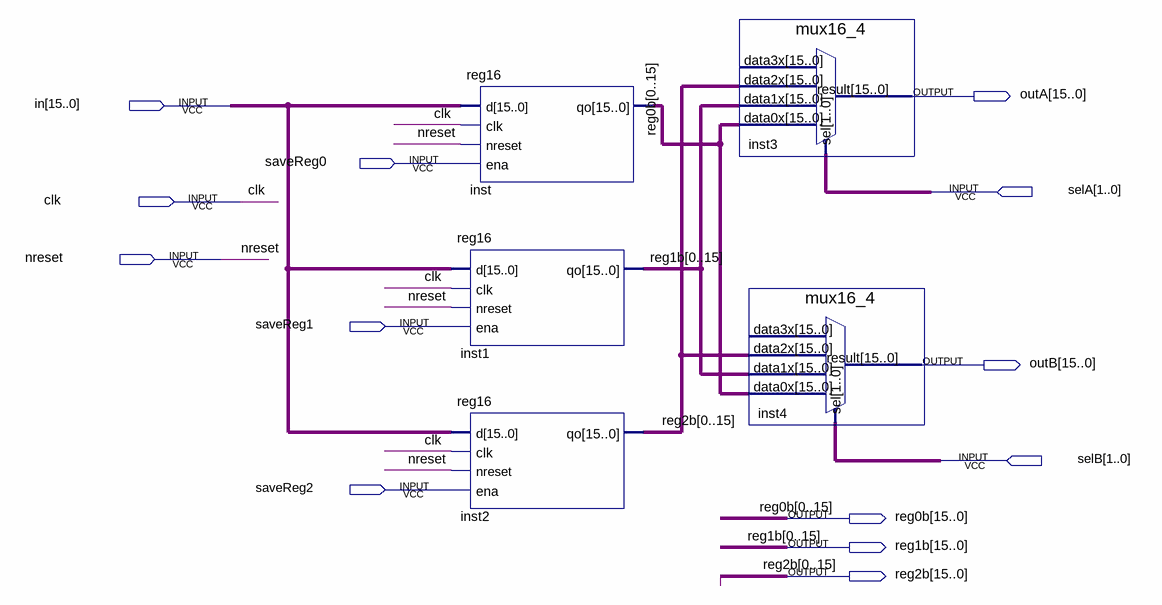
[diagram p0: schematic sheet]
// Quartus schematic regbank.bdf as structural Verilog: 5 symbols, 13 pins
module regbank (
  input  [15:0] in,
  input  saveReg0,
  input  [1:0] selA,
  input  clk,
  input  nreset,
  input  saveReg1,
  input  [1:0] selB,
  input  saveReg2,
  output [15:0] outA,
  output [15:0] outB,
  output [15:0] reg0b,
  output [15:0] reg1b,
  output [15:0] reg2b
);

  reg16 inst (
    .d(in), .clk(clk), .nreset(nreset), .ena(saveReg0),
    .qo({reg0b[0], reg0b[1], reg0b[2], reg0b[3], reg0b[4], reg0b[5], reg0b[6], reg0b[7], reg0b[8], reg0b[9], reg0b[10], reg0b[11], reg0b[12], reg0b[13], reg0b[14], reg0b[15]}));
  reg16 inst1 (
    .d(in), .clk(clk), .nreset(nreset), .ena(saveReg1),
    .qo({reg1b[0], reg1b[1], reg1b[2], reg1b[3], reg1b[4], reg1b[5], reg1b[6], reg1b[7], reg1b[8], reg1b[9], reg1b[10], reg1b[11], reg1b[12], reg1b[13], reg1b[14], reg1b[15]}));
  reg16 inst2 (
    .d(in), .clk(clk), .nreset(nreset), .ena(saveReg2),
    .qo({reg2b[0], reg2b[1], reg2b[2], reg2b[3], reg2b[4], reg2b[5], reg2b[6], reg2b[7], reg2b[8], reg2b[9], reg2b[10], reg2b[11], reg2b[12], reg2b[13], reg2b[14], reg2b[15]}));
  mux16_4 inst3 (
    .data2x({reg2b[0], reg2b[1], reg2b[2], reg2b[3], reg2b[4], reg2b[5], reg2b[6], reg2b[7], reg2b[8], reg2b[9], reg2b[10], reg2b[11], reg2b[12], reg2b[13], reg2b[14], reg2b[15]}),
    .data1x({reg1b[0], reg1b[1], reg1b[2], reg1b[3], reg1b[4], reg1b[5], reg1b[6], reg1b[7], reg1b[8], reg1b[9], reg1b[10], reg1b[11], reg1b[12], reg1b[13], reg1b[14], reg1b[15]}),
    .data0x({reg0b[0], reg0b[1], reg0b[2], reg0b[3], reg0b[4], reg0b[5], reg0b[6], reg0b[7], reg0b[8], reg0b[9], reg0b[10], reg0b[11], reg0b[12], reg0b[13], reg0b[14], reg0b[15]}),
    .sel(selA), .result(outA));  // open: data3x
  mux16_4 inst4 (
    .data2x({reg2b[0], reg2b[1], reg2b[2], reg2b[3], reg2b[4], reg2b[5], reg2b[6], reg2b[7], reg2b[8], reg2b[9], reg2b[10], reg2b[11], reg2b[12], reg2b[13], reg2b[14], reg2b[15]}),
    .data1x({reg1b[0], reg1b[1], reg1b[2], reg1b[3], reg1b[4], reg1b[5], reg1b[6], reg1b[7], reg1b[8], reg1b[9], reg1b[10], reg1b[11], reg1b[12], reg1b[13], reg1b[14], reg1b[15]}),
    .data0x({reg0b[0], reg0b[1], reg0b[2], reg0b[3], reg0b[4], reg0b[5], reg0b[6], reg0b[7], reg0b[8], reg0b[9], reg0b[10], reg0b[11], reg0b[12], reg0b[13], reg0b[14], reg0b[15]}),
    .sel(selB), .result(outB));  // open: data3x
endmodule
